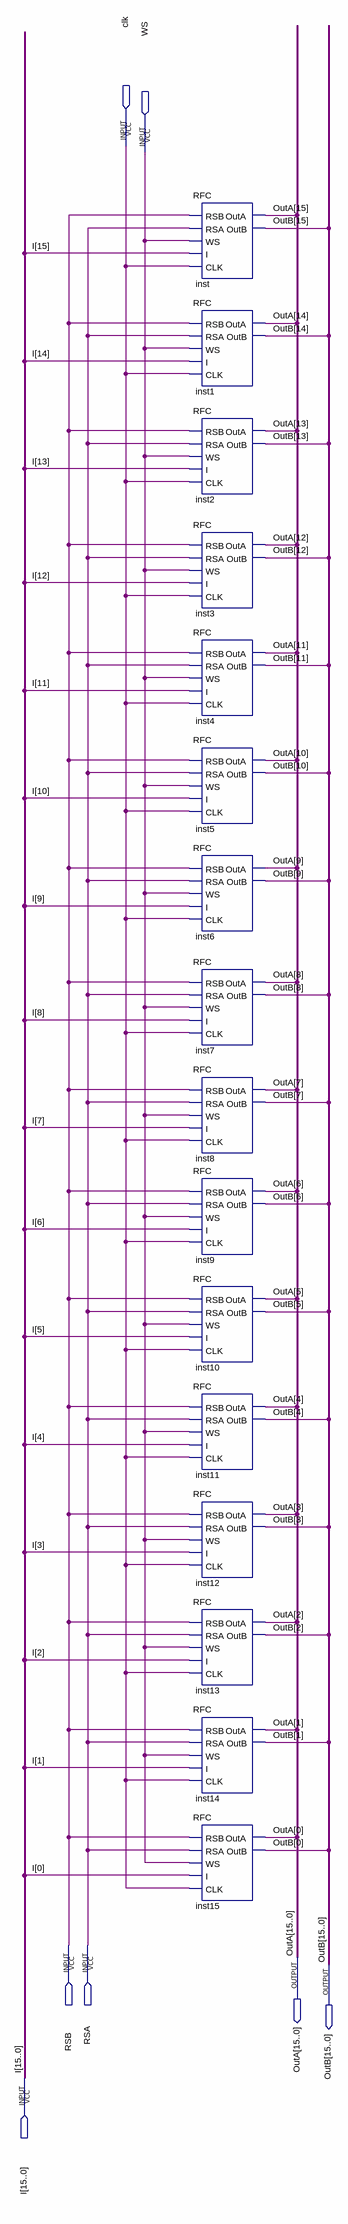
[diagram p0: schematic sheet]
// Quartus schematic RFC_16bit.bdf as structural Verilog: 16 symbols, 7 pins
module RFC_16bit (
  input  clk,
  input  WS,
  input  RSB,
  input  RSA,
  input  [15:0] I,
  output [15:0] OutA,
  output [15:0] OutB
);

  RFC inst (.RSB(RSB), .RSA(RSA), .WS(WS), .I(I[15]), .CLK(clk), .OutA(OutA[15]), .OutB(OutB[15]));
  RFC inst1 (.RSB(RSB), .RSA(RSA), .WS(WS), .I(I[14]), .CLK(clk), .OutA(OutA[14]), .OutB(OutB[14]));
  RFC inst2 (.RSB(RSB), .RSA(RSA), .WS(WS), .I(I[13]), .CLK(clk), .OutA(OutA[13]), .OutB(OutB[13]));
  RFC inst3 (.RSB(RSB), .RSA(RSA), .WS(WS), .I(I[12]), .CLK(clk), .OutA(OutA[12]), .OutB(OutB[12]));
  RFC inst4 (.RSB(RSB), .RSA(RSA), .WS(WS), .I(I[11]), .CLK(clk), .OutA(OutA[11]), .OutB(OutB[11]));
  RFC inst5 (.RSB(RSB), .RSA(RSA), .WS(WS), .I(I[10]), .CLK(clk), .OutA(OutA[10]), .OutB(OutB[10]));
  RFC inst6 (.RSB(RSB), .RSA(RSA), .WS(WS), .I(I[9]), .CLK(clk), .OutA(OutA[9]), .OutB(OutB[9]));
  RFC inst7 (.RSB(RSB), .RSA(RSA), .WS(WS), .I(I[8]), .CLK(clk), .OutA(OutA[8]), .OutB(OutB[8]));
  RFC inst8 (.RSB(RSB), .RSA(RSA), .WS(WS), .I(I[7]), .CLK(clk), .OutA(OutA[7]), .OutB(OutB[7]));
  RFC inst9 (.RSB(RSB), .RSA(RSA), .WS(WS), .I(I[6]), .CLK(clk), .OutA(OutA[6]), .OutB(OutB[6]));
  RFC inst10 (.RSB(RSB), .RSA(RSA), .WS(WS), .I(I[5]), .CLK(clk), .OutA(OutA[5]), .OutB(OutB[5]));
  RFC inst11 (.RSB(RSB), .RSA(RSA), .WS(WS), .I(I[4]), .CLK(clk), .OutA(OutA[4]), .OutB(OutB[4]));
  RFC inst12 (.RSB(RSB), .RSA(RSA), .WS(WS), .I(I[3]), .CLK(clk), .OutA(OutA[3]), .OutB(OutB[3]));
  RFC inst13 (.RSB(RSB), .RSA(RSA), .WS(WS), .I(I[2]), .CLK(clk), .OutA(OutA[2]), .OutB(OutB[2]));
  RFC inst14 (.RSB(RSB), .RSA(RSA), .WS(WS), .I(I[1]), .CLK(clk), .OutA(OutA[1]), .OutB(OutB[1]));
  RFC inst15 (.RSB(RSB), .RSA(RSA), .WS(WS), .I(I[0]), .CLK(clk), .OutA(OutA[0]), .OutB(OutB[0]));
endmodule
